# EAGLE board 261503933xxxx_HW-V1 (EAGLE 7.5.0)
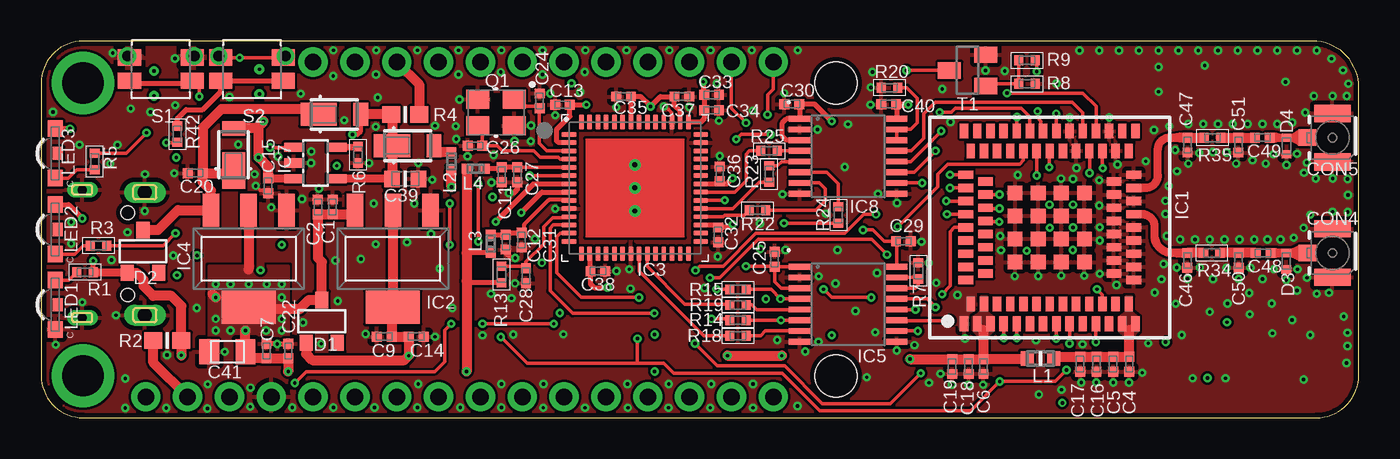
[diagram p3: board, top side]
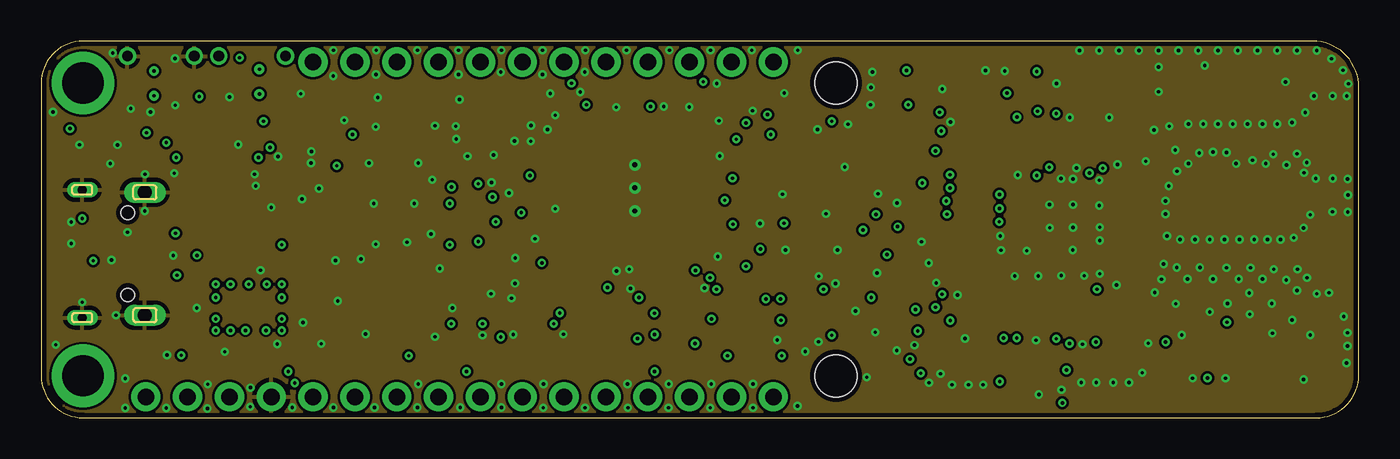
[diagram p4: board, inner layer Route2]
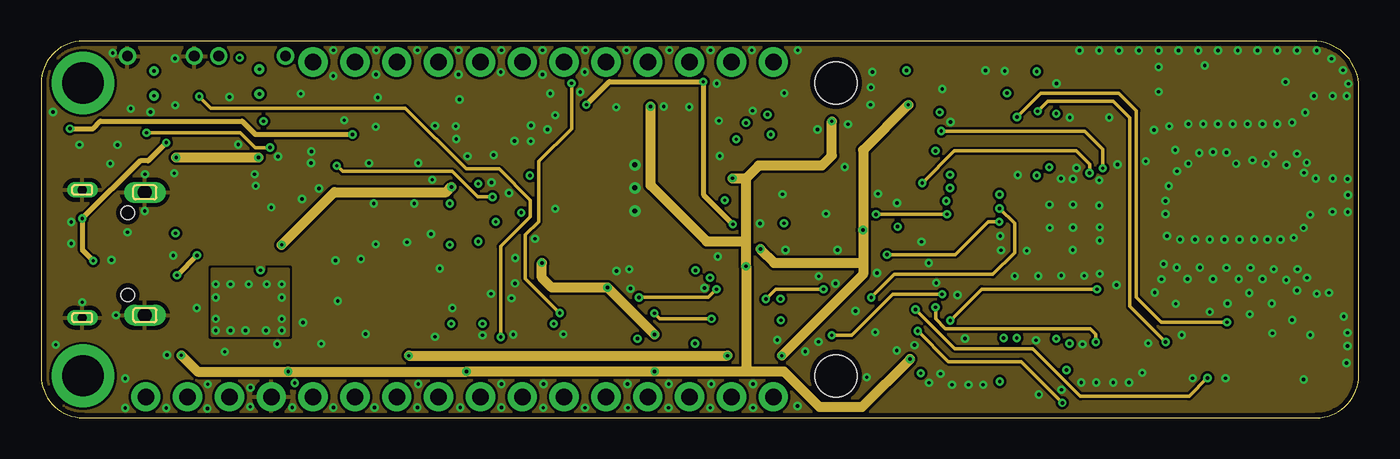
[diagram p5: board, inner layer Route15]
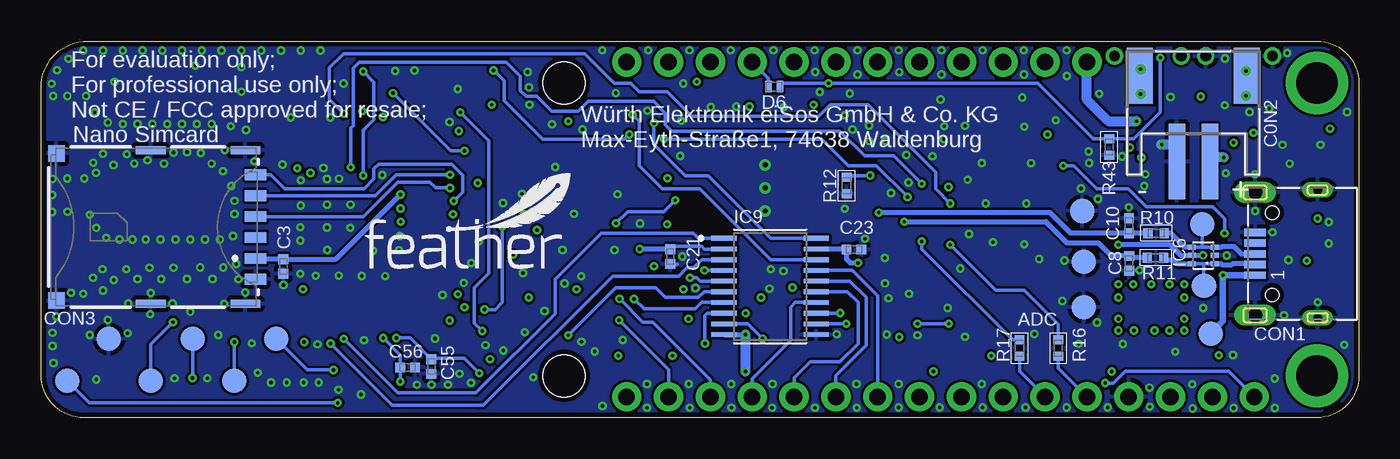
[diagram p6: board, bottom side, seen from below]

Size 80 x 22.86 mm. Coordinates in mm from the lower left corner, seen from the top.
Copper layers (1*2+15*16): Top 0.035mm / dielectric 0.41mm / Route2 0.035mm / dielectric 0.71mm / Route15 0.035mm / dielectric 0.41mm / Bottom 0.035mm
Design rules "default *": minimum track width 0.15mm, minimum drill 0.2mm, track to track 0.15mm, track to pad 0.15mm, pad to pad 0.2mm, via to via 0.2mm, smd to smd 0.2mm, copper to edge 0.3mm, drill to drill 0.3mm, minimum pad ring 0.2mm, minimum via ring 0.15mm, stop-mask expansion 0.05mm, vias tented up to drill 0.7mm, thermal gap 10mil
Net classes: 0 default: width 0.15 mm, drill 0.2 mm, clearance 0.15 mm; 1 VCC: width 0.2 mm, drill 0.2 mm, clearance 0.2 mm to class 0, clearance 0.2 mm; 4 VDDIO: width 0.2 mm, drill 0.2 mm, clearance 0.2 mm to class 0, clearance 0.2 mm to class 1, clearance 0.2 mm to class 2, clearance 0.2 mm to class 3, clearance 0.2 mm
tKeepout: area 15.6,20.3 to 45.7,22.8; area 4.9,0.1 to 35,2.6; area 35,0.1 to 45.8,2.6
tRestrict: area 27.3,17.2 to 27.9,19.7

## Footprints (pad centres in the part's own frame; a part is rotated, then mirrored left to right if it is on the bottom)
JST-PH-2-SMT-RA-ADRASTEA-ANGEPASST = smd 1 x 4.6: 1 1,-3.7; 2 -1,-3.7 | smd 1.6 x 3.4: NC1 -3.25,1.5; NC2 3.25,1.5 | drill 0.2: P$1 3.2,0.3; P$2 3.2,1.8; P$3 -3.2,0.4; P$4 -3.2,1.9
C0402_IPC = smd 0.6 x 0.6: 1 -0.45,0; 2 0.45,0
C0603_IPC = smd 0.95 x 1: 1 -0.8,0; 2 0.8,0
C0805 = smd 1.2 x 1.5: P$1 -1.1,0; P$2 1.1,0
629105150521 = smd 0.45 x 1.3: 1 -1.3,1.05; 2 -0.65,1.05; 3 0,1.05; 4 0.65,1.05; 5 1.3,1.05 | drill 0.85 pad 1.2 long: SHELL -3.725,1.05; SHELL1 3.725,1.05 | drill 0.55 pad 0.9 long: SHELL2 -3.875,-2.75; SHELL3 3.875,-2.75 | hole 0.8: -2.5,0; 2.5,0
693043020611 = smd 0.65 x 1.3: C1 1.91,6.2; C2 -0.63,6.2; C3 -1.9,6.2; C5 3.18,6.2; C6 0.64,6.2; C7 -3.17,6.2 | smd 1 x 1.03: S1 4.465,-5.89; S6 -4.465,-5.89 | smd 0.48 x 1.8: S2 4.66,-0.17; S3 4.66,5.58; S4 -4.67,5.58; S5 -4.67,-0.17
636101111001 = smd 1 x 1.05: 1 0,-1.525 | smd 1.05 x 2.2: 2 1.475,0; 3 -1.475,0
SOT23@1 = smd 0.8 x 1: 1 -0.95,-1.3; 2 0.95,-1.3; 3 0,1.3
WE-VE_FEMTOF_0402 = smd 0.5 x 0.6: 1 -0.5,0; 2 0.5,0
SOD123_POWERDI = smd 0.9 x 1.4: A 1.6,0 | smd 2.2 x 1.4: K -0.95,0
X1-DFN1006-2 = smd 0.4 x 0.7: 1 -0.35,0; 2 0.35,0
WIRL-CELL-2615011136000 = smd 0.508 x 0.89: 1 -5.2,-5.85; 2 -4.8,-4.65; 3 -4.4,-5.85; 4 -4,-4.65; 5 -3.6,-5.85; 6 -3.2,-4.65; 7 -2.8,-5.85; 8 -2.4,-4.65; 9 -2,-5.85; 10 -1.6,-4.65; 11 -1.2,-5.85; 12 -0.8,-4.65; 13 -0.4,-5.85; 14 0,-4.65; 15 0.4,-5.85; 16 0.8,-4.65; 17 1.2,-5.85; 18 1.6,-4.65; 19 2,-5.85; 20 2.4,-4.65; 21 2.8,-5.85; 22 3.2,-4.65; 23 3.6,-5.85; 24 4,-4.65; 25 4.4,-5.85; 26 4.8,-4.65; 27 5.2,-5.85; 44 4.8,4.65; 46 4,4.65; 47 5.2,5.85; 48 3.2,4.65; 49 4.4,5.85; 50 2.4,4.65; 51 3.6,5.85; 52 1.6,4.65; 53 2.8,5.85; 54 0.8,4.65; 55 2,5.85; 56 0,4.65; 57 1.2,5.85; 58 -0.8,4.65; 59 0.4,5.85; 60 -1.6,4.65; 61 -0.4,5.85; 62 -2.4,4.65; 63 -1.2,5.85; 64 -3.2,4.65; 65 -2,5.85; 66 -4,4.65; 67 -2.8,5.85; 68 -4.8,4.65; 69 -3.6,5.85; 71 -4.4,5.85; 73 -5.2,5.85 | smd 0.89 x 0.508: 28 3.9,-2.8; 29 5.1,-3.2; 30 3.9,-2; 31 5.1,-2.4; 32 3.9,-1.2; 33 5.1,-1.6; 34 3.9,-0.4; 35 5.1,-0.8; 36 3.9,0.4; 37 5.1,0; 38 3.9,1.2; 39 5.1,0.8; 40 3.9,2; 41 5.1,1.6; 42 3.9,2.8; 43 5.1,2.4; 45 5.1,3.2; 70 -3.9,2.8; 72 -3.9,2; 74 -3.9,1.2; 75 -5.1,3.2; 76 -3.9,0.4; 77 -5.1,2.4; 78 -3.9,-0.4; 79 -5.1,1.6; 80 -3.9,-1.2; 81 -5.1,0.8; 82 -3.9,-2; 83 -5.1,0; 84 -3.9,-2.8; 85 -5.1,-0.8; 87 -5.1,-1.6; 89 -5.1,-2.4; 91 -5.1,-3.2 | smd 0.89 x 0.89: 86 -2.1,2.1; 88 -0.7,2.1; 90 0.7,2.1; 92 2.1,2.1; 93 -2.1,0.7; 94 -0.7,0.7; 95 0.7,0.7; 96 2.1,0.7; 97 -2.1,-0.7; 98 -0.7,-0.7; 99 0.7,-0.7; 100 2.1,-0.7; 101 -2.1,-2.1; 102 -0.7,-2.1; 103 0.7,-2.1; 104 2.1,-2.1
SOT223-4 = smd 1 x 2: 1 -2.3,-2.95; 2 0,-2.95; 3 2.3,-2.95 | smd 3.3 x 2: 4 0,2.95
VQFN-56 = smd 0.9 x 0.3: 1 -4,3.25; 2 -4,2.75; 3 -4,2.25; 4 -4,1.75; 5 -4,1.25; 6 -4,0.75; 7 -4,0.25; 8 -4,-0.25; 9 -4,-0.75; 10 -4,-1.25; 11 -4,-1.75; 12 -4,-2.25; 13 -4,-2.75; 14 -4,-3.25; 29 4,-3.25; 30 4,-2.75; 31 4,-2.25; 32 4,-1.75; 33 4,-1.25; 34 4,-0.75; 35 4,-0.25; 36 4,0.25; 37 4,0.75; 38 4,1.25; 39 4,1.75; 40 4,2.25; 41 4,2.75; 42 4,3.25 | smd 0.3 x 0.9: 15 -3.25,-4; 16 -2.75,-4; 17 -2.25,-4; 18 -1.75,-4; 19 -1.25,-4; 20 -0.75,-4; 21 -0.25,-4; 22 0.25,-4; 23 0.75,-4; 24 1.25,-4; 25 1.75,-4; 26 2.25,-4; 27 2.75,-4; 28 3.25,-4; 43 3.25,4; 44 2.75,4; 45 2.25,4; 46 1.75,4; 47 1.25,4; 48 0.75,4; 49 0.25,4; 50 -0.25,4; 51 -0.75,4; 52 -1.25,4; 53 -1.75,4; 54 -2.25,4; 55 -2.75,4; 56 -3.25,4 | drill 0.3: P$1 0,1.4; P$2 0,0; P$3 0,-1.4
PW16(TSSOP16) = smd 0.35 x 1.3: 1 -2.275,-2.95; 2 -1.625,-2.95; 3 -0.975,-2.95; 4 -0.325,-2.95; 5 0.325,-2.95; 6 0.975,-2.95; 7 1.625,-2.95; 8 2.275,-2.95; 9 2.275,2.95; 10 1.625,2.95; 11 0.975,2.95; 12 0.325,2.95; 13 -0.325,2.95; 14 -0.975,2.95; 15 -1.625,2.95; 16 -2.275,2.95
WE-TVS_SOT563 = smd 0.5 x 0.3: 1 -0.7,0.5; 2 -0.7,0; 3 -0.7,-0.5; 4 0.7,-0.5; 5 0.7,0; 6 0.7,0.5
SOT23-5 = smd 0.55 x 1.2: 1 -0.95,-1.3; 2 0,-1.3; 3 0.95,-1.3; 4 0.95,1.3; 5 -0.95,1.3
SOP65P640X120-20N = smd 1.6 x 0.3: 1 -2.8,2.925; 2 -2.8,2.275; 3 -2.8,1.625; 4 -2.8,0.975; 5 -2.8,0.325; 6 -2.8,-0.325; 7 -2.8,-0.975; 8 -2.8,-1.625; 9 -2.8,-2.275; 10 -2.8,-2.925; 11 2.8,-2.925; 12 2.8,-2.275; 13 2.8,-1.625; 14 2.8,-0.975; 15 2.8,-0.325; 16 2.8,0.325; 17 2.8,0.975; 18 2.8,1.625; 19 2.8,2.275; 20 2.8,2.925
L0603_WE-MK = smd 0.8 x 0.9: 1 -0.8,0; 2 0.8,0
L0402_WE-MK = smd 0.6 x 0.6: P$1 -0.55,0; P$2 0.55,0
WL-SMSW_1204_A = smd 1 x 0.9: 1 -1.5,0; 2 1.5,0 | smd 0.8 x 0.6: 3 0,-0.15
FEATHERWING_80MM = drill 1 pad 1.778: 1 6.35,1.27; 2 8.89,1.27; 3 11.43,1.27; 4 13.97,1.27; 5 16.51,1.27; 6 19.05,1.27; 7 21.59,1.27; 8 24.13,1.27; 9 26.67,1.27; 10 29.21,1.27; 11 31.75,1.27; 12 34.29,1.27; 13 36.83,1.27; 14 39.37,1.27; 15 41.91,1.27; 16 44.45,1.27; 17 44.45,21.59; 18 41.91,21.59; 19 39.37,21.59; 20 36.83,21.59; 21 34.29,21.59; 22 31.75,21.59; 23 29.21,21.59; 24 26.67,21.59; 25 24.13,21.59; 26 21.59,21.59; 27 19.05,21.59; 28 16.51,21.59 | drill 2.5 pad 3.81: P$1 2.54,20.32; P$2 2.54,2.54 | hole 2.54: 48.26,20.32; 48.26,2.54
WE-XTAL_CFPX-180 = smd 1.4 x 1.15: 1 -1.1,-0.8; 2 1.1,-0.8; 3 1.1,0.8; 4 -1.1,0.8
R0402_IPC = smd 0.55 x 0.6: 1 -0.5,0; 2 0.5,0
R0603_IPC = smd 1.1 x 1: 1 -0.85,0; 2 0.85,0
434331013822 = smd 1.4 x 1: 1 -1.9,0.7; 2 1.9,0.7; 3 1.9,-0.7; 4 -1.9,-0.7 | drill 0.65 pad 0.78: 5 -2.025,-0.8; 6 2.025,-0.8
BSS138 = smd 1 x 1.4: D 0,1.1; G -0.95,-1.1; S 0.95,-1.1
TP15R = smd 1.5 x 1.5: P$1 0,0

## Placement (x,y rotation side)
C0N2  LiPoLy-Plug  [JST-PH-2-SMT-RA-ADRASTEA-ANGEPASST]  10.05,19.25 0 bottom
C1  100nF  [C0402_IPC]  17.7,12.8 270 top
C2  1uF  [C0402_IPC]  16.8,12.8 90 top
C3  100nF  [C0402_IPC]  65.3,9.18 270 bottom
C4  100nF  [C0402_IPC]  66.06,3.25 90 top
C5  10uF  [C0402_IPC]  65.08,3.25 270 top
C6  100nF  [C0402_IPC]  57.21,3.1 90 top
C7  4.7uF  [C0402_IPC]  13.68,4.05 90 top
C8  10pF  [C0402_IPC]  13.95,9.37 90 bottom
C9  1uF  [C0402_IPC]  20.83,4.92 180 top
C10  10pF  [C0402_IPC]  13.95,11.65 270 bottom
C11  4.7uF  [C0402_IPC]  27.96,14.75 270 top
C12  4.7uF  [C0402_IPC]  28.21,10.66 270 top
C13  4.7uF  [C0402_IPC]  31.65,19 180 top
C14  100nF  [C0402_IPC]  22.77,4.92 180 top
C15  10uF  [C0402_IPC]  13.78,14.09 270 top
C16  10uF  [C0402_IPC]  64.08,3.25 270 top
C17  1uF  [C0402_IPC]  63.08,3.25 270 top
C18  10uF  [C0402_IPC]  56.31,3.1 270 top
C19  10uF  [C0402_IPC]  55.31,3.1 270 top
C20  100nF  [C0402_IPC]  9.35,14.85 0 top
C21  100nF  [C0402_IPC]  41.8,9.78 270 bottom
C22  100nF  [C0402_IPC]  15,4.05 270 top
C23  100nF  [C0402_IPC]  30.66,10.21 0 bottom
C24  27pF  [C0402_IPC]  30.26,19.23 270 top
C25  100nF  [C0402_IPC]  44.53,9.62 270 top
C26  27pF  [C0402_IPC]  26.34,16.51 0 top
C27  100nF  [C0402_IPC]  28.91,14.75 90 top
C28  100nF  [C0402_IPC]  29.43,8.62 90 top
C29  100nF  [C0402_IPC]  52.35,10.71 180 top
C30  100nF  [C0402_IPC]  45.58,19.04 0 top
C31  100nF  [C0402_IPC]  29.18,10.78 90 top
C32  100nF  [C0402_IPC]  41.1,11.1 90 top
C33  100nF  [C0402_IPC]  40.7,19.6 180 top
C34  100nF  [C0402_IPC]  40.7,18.66 180 top
C35  100nF  [C0402_IPC]  35.36,19.5 0 top
C36  100nF  [C0402_IPC]  41.2,14.8 270 top
C37  100nF  [C0402_IPC]  38.9,19.5 180 top
C38  100nF  [C0402_IPC]  33.8,8.9 180 top
C39  10uF  [C0603_IPC]  22.1,14.5 180 top
C40  100nF  [C0402_IPC]  51.45,19.04 0 top
C41  47µF  [C0805]  11.3,4 180 top
C46  n.m.  [C0402_IPC]  69.59,9.55 90 top
C47  n.m.  [C0402_IPC]  69.6,16.55 90 top
C48  100pF  [C0402_IPC]  74.19,10 180 top
C49  100pF  [C0402_IPC]  74.15,17 180 top
C50  n.m.  [C0402_IPC]  72.7,9.55 90 top
C51  n.m.  [C0402_IPC]  72.69,16.55 90 top
C55  100nF  [C0402_IPC]  56.31,3.1 90 bottom
C56  n.m.  [C0402_IPC]  57.75,3.05 180 bottom
CON1  Micro_USB  [629105150521]  5.25,9.95 90 bottom
CON3  693043020611  [693043020611]  73.18,11.58 270 bottom
CON4  636101111001  [636101111001]  78.4,10 270 top
CON5  636101111001  [636101111001]  78.4,17 270 top
D1  n.m.  [SOT23@1]  17.04,5.85 0 top
D2  n.m.  [SOT23@1]  6.18,10.1 0 top
D3  8231706A  [WE-VE_FEMTOF_0402]  75.59,9.5 270 top
D4  8231706A  [WE-VE_FEMTOF_0402]  75.61,16.5 270 top
D5  DFLS130L-7  [SOD123_POWERDI]  22.25,16.52 0 top
D6  BAT540402_X1-DFN1006-2  [X1-DFN1006-2]  35.5,20.1 180 bottom
D7  DFLS130L-7  [SOD123_POWERDI]  17.8,18.41 0 top
D8  DFLS130L-7  [SOD123_POWERDI]  11.69,15.96 90 top
IC1  WIRL-CELL-2615011136000  [WIRL-CELL-2615011136000]  61.23,11.55 0 top
IC2  TLV1117LV18DCY  [SOT223-4]  21.35,9.65 180 top
IC3  FT4232H-56Q  [VQFN-56]  36.05,13.95 0 top
IC4  TLV1117LV33DCY  [SOT223-4]  12.6,9.65 180 top
IC5  SN74AVC4T245PWR  [PW16(TSSOP16)]  48.99,6.89 270 top
IC6  82400152  [WE-TVS_SOT563]  9.45,9.86 180 bottom
IC7  MCP73831T-2ACI/OT  [SOT23-5]  16.65,15.46 270 top
IC8  SN74AVC4T245PWR  [PW16(TSSOP16)]  48.99,15.88 270 top
IC9  TXS0108EPWR  [SOP65P640X120-20N]  35.74,7.97 0 bottom
L1  742792625  [L0603_WE-MK]  60.67,3.6 0 top
L2  7427927311  [L0402_WE-MK]  24.91,15.57 270 top
L3  7427927311  [L0402_WE-MK]  27.29,10.56 270 top
L4  7427927311  [L0402_WE-MK]  26.39,15.12 180 top
LED1  Red  [WL-SMSW_1204_A]  0.86,6.86 90 top
LED2  Blue  [WL-SMSW_1204_A]  0.86,11.43 90 top
LED3  Yellow  [WL-SMSW_1204_A]  0.86,16.05 90 top
MS1  FEATHERWING_80MM  [FEATHERWING_80MM]  0,0 0 top
Q1  12MHz/±20 ppm  [WE-XTAL_CFPX-180]  27.61,18.53 180 top
R1  4k7R  [R0402_IPC]  2.66,8.84 0 top
R2  0R  [R0603_IPC]  7.66,4.68 180 top
R3  2.2k  [R0402_IPC]  3.48,10.45 0 top
R4  0R  [R0603_IPC]  22.1,18.4 180 top
R5  4k7R  [R0402_IPC]  3.25,15.55 90 top
R6  5k1R  [R0402_IPC]  19.23,15.96 90 top
R7  100k  [R0402_IPC]  53.26,8.92 90 top
R8  100k  [R0402_IPC]  59.84,20.27 0 top
R9  10k  [R0402_IPC]  59.84,21.7 180 top
R10  10R  [R0402_IPC]  12.3,11.2 180 bottom
R11  10R  [R0402_IPC]  12.34,9.71 0 bottom
R12  12k  [R0402_IPC]  31.1,14.09 90 bottom
R13  1k  [R0402_IPC]  27.95,8.69 90 top
R14  10R  [R0402_IPC]  42.3,5.92 0 top
R15  10R  [R0402_IPC]  42.3,7.79 0 top
R16  n.m.  [R0402_IPC]  18.25,4.22 270 bottom
R17  n.m.  [R0402_IPC]  20.6,4.22 270 bottom
R18  10R  [R0402_IPC]  42.3,4.98 0 top
R19  10R  [R0402_IPC]  42.3,6.84 0 top
R20  100k  [R0402_IPC]  51.5,20.04 180 top
R22  10R  [R0402_IPC]  43.5,12.6 0 top
R23  10R  [R0402_IPC]  44.2,14.8 90 top
R24  10R  [R0402_IPC]  48.4,12.3 90 top
R25  10R  [R0402_IPC]  44.2,16.2 0 top
R34  0R  [R0402_IPC]  71.07,10 180 top
R35  0R  [R0402_IPC]  71.11,17 180 top
R42  100R  [R0402_IPC]  8.27,17.21 90 top
R43  1k  [R0402_IPC]  15.16,16.43 270 bottom
S1  [434331013822]  7.26,21.16 180 top
S2  [434331013822]  12.8,21.16 180 top
T1  BSS138  [BSS138]  56.24,21.09 90 top
TP1  TP15R  [TP15R]  78.43,2.25 0 bottom
TP2  TP15R  [TP15R]  73.35,2.25 0 bottom
TP3  TP15R  [TP15R]  70.81,4.79 0 bottom
TP4  TP15R  [TP15R]  68.27,2.25 0 bottom
TP5  TP15R  [TP15R]  65.73,4.79 0 bottom
TP6  TP15R  [TP15R]  75.89,4.79 0 bottom
TP7  TP15R  [TP15R]  9.5,11.75 0 bottom
TP8  TP15R  [TP15R]  9.4,8 0 bottom
TP9  TP15R  [TP15R]  9,5.1 0 bottom
TP10  TP15R  [TP15R]  16.8,12.55 0 bottom
TP11  TP15R  [TP15R]  16.7,9.47 0 bottom
TP12  TP15R  [TP15R]  16.7,6.7 0 bottom
U$4  [FEATHER_12MM]  60.4,9.05 0 bottom

## Tracks (layer width: path | path; a pad name or v marks a point on that pad's centre or on a via)
1V8  (via drill 0.2)
  Top 0.2: 52,9.22 IC5.16 51.95,10.56 52,10.62 C29.2 51.19,10.71 50.5,11.4 v49.9,11.4
  Top 0.3: 51.94,19 51.94,18.16 IC8.16
  Top 0.4: v52.65,19 51.94,19 C40.2
  Top 0.6: IC2.2 IC2.4 21.22,6.57 21.28,6.51 C9.1 C14.2 v22.32,3.77 22.05,3.5 16.46,3.5 16.09,3.87 D1.1 | v41.66,3.77 v44.97,3.77
  Route15 0.6: v52.65,19 49.9,16.25 v49.9,11.4 49.9,9.4 | v44.97,3.77 49.9,8.7 49.9,9.4 | v43.66,10.23 44.5,9.4 49.9,9.4 | v22.32,3.77 v41.66,3.77
  Bottom 0.2: IC9.2 38.55,10.23 39.73,10.23 39.9,10.4 41.63,10.4 C21.1 41.73,10.3 | v43.66,10.23
  Bottom 0.3: C21.1 v43.66,10.23
3V
  Top 0.6: MS1.2 6.81,3.35 R2.2
3V3  (via drill 0.2)
  Top 0.2: IC1.4 57.24,6.89 | IC5.3 44.94,7.87 44.53,8.27 C25.2 | v42.8,9.2 44.51,9.2 C25.2 | IC5.1 44.55,9.16 C25.2 | R1.2 | 41.05,14.2 C36.2 | R42.1 8.26,16.7 v7.6,16.7
  Top 0.3: LED2.2 1.67,12.93 v2.5,12.1 | IC8.1 45.25,18.15 45,17.9 45,17.1 45.25,16.85 IC8.3 | IC3.44 38.8,18.6 38.45,18.95 C37.2 37.6,19.5 v37,18.9 36.4,19.5 C35.2 IC3.50 | 57.2,5.33 IC1.3 | R1.2 v3.17,9.54 | 3.19,8.8 R1.2 | IC3.36 41.05,14.2 | IC3.16 33.3,8.95 C38.2 33.35,8.12 33.57,7.9 v34.39,7.9 | 25.84,10 25.85,10.02 L3.P$2 | R13.1 25.95,8.19 25.84,8.3 | C36.2 41.35,14.2 41.63,14.2 v41.97,14.54 | IC8.1 46.02,18.17 | v48.01,18 46.97,19.04 C30.2 46.05,19.02 IC8.1
  Top 0.4: R13.1 27.9,8.13 | C6.2 57.2,3.6
  Top 0.5: D2.1 3.19,8.8
  Top 0.6: v52.76,3.56 C19.1 C18.1 C6.2 | L1.1 59.83,3.56 C6.2 | IC4.4 12.95,7.05 13.4,6.6 15.7,6.6 16.25,7.15 D1.3 17.04,9.46 16.8,9.7 C2.1 | IC4.2 12.6,9 | D2.1 5.8,8.8 6.2,8.4 6.2,8 6.8,7.4 7.9,7.4 8.51,6.79 R2.1 v8.51,3.79 | 10.4,7.5 v10.6,7.3 | C2.1 C1.2 | C2.1 18.8,12.35 IC2.3 | L4.P$2 25.84,10 25.84,8.3 v25.84,2.81 v25.83,2.8 | v15,2.8 C22.2 C7.1 12.8,3.6 C41.P$1 v12.4,5.3 | 57.2,5.33 C6.2
  Route15 0.3: v3.17,9.54 2.5,10.2 v2.5,12.1 6,15.6 6.5,15.6 v7.6,16.7
  Route15 0.6: v48.01,18 48.01,15.9 47.4,15.3 43.56,15.3 42.8,14.54 | v52.76,3.56 49.84,0.64 47.27,0.64 45.1,2.8 42.8,2.8 | 42.8,2.8 v37.24,2.8 v25.83,2.8 v15,2.8 9.5,2.8 v8.51,3.79 | 42.8,10.7 v42.8,9.2 42.8,2.8 | 42.8,10.7 42.8,14.54 | 42.8,10.7 40.4,10.7 37,14.1 v37,18.9 | v41.97,14.54 42.8,14.54 | v37.24,5.04 v34.39,7.9 31,7.9 30.4,8.5 v30.4,9.4
  Bottom 0.2: 31.14,10.24 C23.1
  Bottom 0.3: IC9.19 31.14,10.24 | C23.1 31.11,9.61 30.9,9.4 v30.4,9.4 | IC9.10 v37.24,5.04
  Bottom 0.6: v37.24,5.04 v37.24,2.8
  other vias: 14.6,5.3 10.6,5.3 10.6,8.1 13.65,5.3 14.6,8.1 14.6,7.3 13.7,8.1 11.5,8.1 14.6,6 10.6,6 12.6,8.1 11.5,5.3
  pour Top: 15,9.2 15,4.8 10.2,4.8 10.2,9.2
  pour Top (rank 2, no thermals): 57.39,7.33 57.08,7.33 57.08,6.4 56.6,6.1 56.6,5.3 57.8,5.3 57.8,6.1 57.3,6.5
  pour Top (rank 2, no thermals): 56.6,5.3 57,4.9 57,4.7 57.4,4.7 57.4,4.9 57.8,5.3
  pour Route15 (no thermals): 15,9 15,5 10.4,5 10.4,9
3V3_FEM
  Top 0.2: IC1.27 66.42,5.71
  Top 0.3: 66.06,5.33 IC1.27
  Top 0.6: L1.2 61.58,3.7 C17.1 C16.1 C5.1 C4.2 66.06,5.33
  pour Top (no thermals): 65.9,4.8 65.9,4.75 66.26,4.74 66.25,4.9
  pour Top (rank 2, no thermals): 66.19,7.33 65.88,7.33 65.88,6.4 65.41,6.08 65.41,5.3 66.61,5.3 66.61,6.08 66.19,6.4
  pour Top (rank 2, no thermals): 65.41,5.3 65.84,4.9 65.84,4.71 66.21,4.7 66.23,4.9 66.61,5.3
5V_IN
  Top 0.5: 11.32,14.65 D8.K
  Top 0.6: C20.2 9.8,17.6 10.95,18.75 16.48,18.75 16.82,18.41 D7.K | C20.2 11.53,14.85 D8.K | C20.2 9.8,14.3 10.3,13.8 IC4.3 8.3,12.6 7.1,11.4 D2.3
/RESET_3V3  (via drill 0.2)
  Top 0.2: v31.12,5.7 v26.8,5.7 | v15.4,2.1 16.1,2.8 23.9,2.8 24.5,3.4 24.5,5.3 v24.9,5.7
  Bottom 0.2: IC9.12 v31.12,5.7 | v26.8,5.7 v24.9,5.7 | MS1.1 7.89,2.81 14.19,2.81 14.9,2.1 v15.4,2.1
ADC0  (via drill 0.2)
  Top 0.2: 61.65,17.41 IC1.59 v61.63,18.46 | v24.8,10.5 v24.8,13
  Bottom 0.2: v61.63,18.46 62.51,19.33 62.51,21.23 61.64,22.1 47,22.1 45.2,20.3 44.2,20.3 43.7,19.8 42,19.8 40.5,18.3 32.8,18.3 32.1,19 29.8,19 25.7,14.9 25.7,13.9 v24.8,13 | R16.1 18.25,5.67 20.32,7.74 22.04,7.74 v24.8,10.5
ADC1  (via drill 0.2)
  Top 0.2: IC1.56 61.2,16.16 v61.2,15.2 | v26.54,10.7 v26.54,14.2
  Bottom 0.2: v61.2,15.2 61.2,17.6 61.06,17.74 61.06,21.23 60.7,21.59 51.77,21.59 50.9,20.72 50.9,19.86 50.55,19.51 49.91,19.51 49,18.6 47.4,18.6 46.8,19.2 42.82,19.2 42.1,18.48 42.1,17.8 41.7,17.4 31.5,17.4 30,15.9 28.24,15.9 v26.54,14.2 | v26.54,10.7 26.54,10.24 21.02,4.72 R17.1
ADC_0
  Bottom 0.2: MS1.5 18.25,3.01 R16.2
ADC_1
  Bottom 0.2: MS1.6 20.6,2.82 R17.2
D+
  Bottom 0.2: IC6.4 9.45,10.36 | 9.45,10.36 IC6.3 8.65,10.36 | TP7.P$1 9.5,10.4 9.45,10.36
  Bottom 0.3: 8.65,10.36 8.65,10.35 | CON1.3 7.15,9.95 7.6,10.4 8.3,10.4 8.35,10.36 IC6.3 | IC6.4 10.55,10.36 11.4,11.2 R10.1
D-
  Bottom 0.2: IC6.6 9.45,9.36 | 9.45,9.36 IC6.1 | TP8.P$1 9.4,9.3 9.45,9.36
  Bottom 0.3: IC6.1 | CON1.2 6.36,9.36 7.64,9.36 7.7,9.3 8.3,9.3 8.36,9.36 IC6.1 | R11.2 11.72,9.6 11.3,9.6 11.05,9.36 IC6.6
FEATHER_USB
  Top 0.6: MS1.26 22.95,20.23 R4.1
FTDI_1V8_VCORE  (via drill 0.2)
  Top 0.2: 40.2,19.65 C33.2 | 40.95,11.7 C32.2
  Top 0.3: C33.2 C34.2 40.25,18.15 40.05,17.95 IC3.43 | v40.2,20.4 40.2,19.65 | v41.99,11.75 41.8,11.55 C32.2 | IC3.31 40.95,11.7 | IC3.2 31.4,16.7 31.3,16.8 31.3,17.5 32.1,18.3 C13.1 v33.1,19
  Route15 0.3: v33.1,19 34.5,20.4 v40.2,20.4 40.2,13.54 v41.99,11.75
FTDI_CTS#_CH-C
  Top 0.2: IC3.35 42.1,13.7 42.8,14.4 42.8,16 43,16.2 R25.1
FTDI_RESET
  Top 0.2: R13.2 29.32,9.19 C28.2 29.43,9.46 30.5,10.53 30.5,11.6 31.05,12.15 32,12.15 IC3.11
FTDI_RTS#_CH-C  (via drill 0.2)
  Top 0.2: IC3.34 v41.5,13.2 | v45.1,11.8 R24.1
  Bottom 0.2: v41.5,13.2 42.2,12.5 44.4,12.5 v45.1,11.8
FTDI_RXD_CH-A  (via drill 0.2)
  Top 0.2: IC3.13 31.5,11.2 31.3,11 31.3,8.8 32.8,7.3 v36.3,7.3 | R15.1 41.78,7.8 v41,7.8
  Route15 0.2: v41,7.8 40.5,7.3 v36.3,7.3
FTDI_RXD_CH-B
  Top 0.2: IC3.23 36.8,9.18 39.08,6.9 41.74,6.9 R19.1
FTDI_RXD_CH-C
  Top 0.2: IC3.33 42,12.7 43.6,14.3 R23.1
FTDI_TXD_CH-A  (via drill 0.2)
  Top 0.2: IC3.12 31.1,11.7 30.9,11.5 30.9,7.7 32.26,6.34 v37.23,6.34 | v40.7,6 41.72,6 R14.1
  Route15 0.2: v37.23,6.34 37.57,6 v40.7,6
FTDI_TXD_CH-B
  Top 0.2: IC3.22 36.3,8.9 40.22,4.98 R18.1
FTDI_TXD_CH-C
  Top 0.2: IC3.32 41.4,12.2 41.5,12.3 42.7,12.3 R22.1
GND  (via drill 0.2)
  Top 0.2: IC3.45 38.3,18.5 37.91,18.89 v37.8,18.89 | 13.7,13.6 13.5,13.8 13.3,13.8 v13.03,14.07
  Top 0.3: v28.78,9.7 28.51,9.7 28.21,10 C12.2 | C27.1 28.91,13.87 28.7,13.64 v28.4,13.64 | C7.2 13.71,4.47 v14.33,4.47 14.97,4.47 C22.1
  Bottom 0.2: 41.37,9.33 C21.2 | 41.4,9.3 41.7,9.3
  Bottom 0.6: 12,16.6 11.1,16.6
  other vias: 14.38,15.87 12.71,1.82 22.9,2.05 27.94,2.05 30.48,0.6 33.02,0.61 35.6,2.05 38.09,0.6 40.68,2.05 43.22,2.05 55.3,2 65.08,2.14 57.19,2 56.3,2 67.22,4.52 66.05,2.14 63.15,2.14 64.06,2.14 53.02,4.41 33.01,20.98 31.21,12.69 28.74,16.8 35.71,9.01 26.8,5 31.7,5.06 51.94,4.08 44.7,4.71 56.09,4.8 60.58,1.41 60.41,4.71 45.01,13.56 46.39,4.01 22.64,13 19.91,15.46 25.17,17.7 20.31,17.66 15.83,13.28 23.91,17.72 30.43,20.84 62.87,15.16 65.35,15.38 62.65,14.48 61.65,20.29 58.51,21.05 59.3,14.73 64.85,18.23 47.13,17.5 50.38,20.05 50.8,13.6 69.65,15.43 70.31,16.07 71.96,16.11 72.55,15.43 76.67,14.88 79.32,14.49 78.42,14.53 72.75,10.82 71.85,10.82 70.95,10.82 70.05,10.82 69.15,10.82 69.65,17.82 70.55,17.82 71.45,17.82 73.25,17.82 74.15,17.82 77.27,19.52 78.41,19.52 75.59,8.36 72.71,8.43 71.96,9.11 70.35,9.12 69.6,8.43 78.19,7.58 75.95,5.92 48.99,17.82 59.12,8.6 60.53,8.61 61.94,8.62 19.41,9.63 27.31,7.53 28.55,7.25 48.34,10.19 47.22,8.59 43.65,11.79 45.2,10.19 51.95,13.04 4.34,22.14 8.12,21.8 24.2,9.05 39.34,18.87 54.59,2.67 29.73,16.79 8.08,14.85 17,4.49 69.91,2.39 5.1,2.38 29.98,10.87 15.24,0.62 12.69,0.67 35.77,7.83 23.91,4.92 30.91,19.69 41.15,18.03 43.2,18.64 41.2,15.89 34.91,18.85 22.21,10.65 20.31,10.53 8.02,9.85 16.87,13.92 24.96,6.66 53.45,10.69 41.08,9.78 62.45,18.23 64.27,11.56 58.28,10.16 64.25,12.88 64.27,10.77 65.28,8.05 67.61,7.59 68.27,12.37 67.56,17.46 70.95,6.42 77.05,5.03 74.75,5.12 25.41,19.32 25.2,16.92 77.39,14.53 77.05,12.32 68.27,13.16 68.97,14.96 77.45,7.53 76.75,18.52 18.4,18.05 27.47,15.96 30.74,17.5 19.7,5.08 64.25,14.41 61.22,12.94 62.65,12.94 62.65,11.54 61.23,11.54 62.63,10.19 58.23,11.04 59.84,10.13 61.91,14.52 45.94,22.3 47.65,12.38 55.2,17.95 15.9,5.79 7.6,0.58 13.96,12.77 1.83,11.88 1.83,10.57 63.23,4.46 4.26,9.57 27.34,14.29 72.35,17.82 75.05,17.82 75.95,17.93 73.55,15.62 74.35,15.43 75.61,15.34 73.65,10.82 74.45,10.82 75.25,10.82 76.05,10.93 78.4,12.51 79.33,12.49 73.42,9.11 74.83,9.02 76.25,7.72 79.08,6.14 67.06,15.56 68.47,14.06 68.35,11.03 68.15,9.32 4.54,6.21 9.44,6.67 6.29,12.55 8.14,18.96 7.64,3.8 17.86,9.55 5.44,18.77 23.75,14.45 28.77,8.15 27.91,20.98 25.34,20.84 20.34,20.84 17.73,20.74 43.14,22.3 40.64,22.3 38.14,22.3 35.54,22.3 33.04,22.3 30.44,22.3 27.94,22.3 25.34,22.3 22.84,22.3 20.34,22.3 17.74,22.3 17.74,0.62 20.24,0.62 22.84,0.62 25.44,0.62 27.94,0.62 35.62,0.61 40.62,0.61 43.22,0.61 45.92,0.71 50.12,2.45 48.22,8.15 73.38,6.28 50.47,20.98 57.34,21.09 54.7,19.95 63.05,22.29 67.84,21.29 67.84,19.79 78.34,21.79 75.55,20.39 70.64,21.39 66.85,2.73 79.25,3.33 50.74,8.79 50.65,5.18 49.45,6.49 48.79,15.21 64.28,8.73 10.12,2.02 16.38,15.46 29.74,17.75 2.33,16.57 2.49,7.01 12.96,14.79 5.24,11.27 0.89,4.43 18,7.08 40.27,7.88 38.1,2.05 30.5,2.05 10.09,0.56 5.1,0.58 41.02,20.29 47.19,4.62 53.91,2.12 54.34,8.19 53.88,9.38 50.34,19 69.25,5.03 6.64,18.57 4.64,16.57 23.67,11.15 16.41,16.16 22.89,15.46 28.66,5.05 76.27,9.02 76.25,16.02 76.84,15.48 76.85,8.49 76.65,11.53 79.27,19.53 13.32,8.96 6.3,14.78 15.76,19.67 20.43,19.44 34.93,8.91 71.15,16.12 74.81,15.99 74.15,8.43 71.15,8.43 61.95,1.7 76.65,2.33 71.91,2.39 11.44,19.48 73.35,7.58 72.02,6.93 74.71,6.93 68.95,9.12 25.89,15.87 55.63,7.46 68.5,17.69 20.2,13 11.14,4 63.34,8.62 32.73,19.77 45.12,19.7 31.21,18.36 4.2,15.43 68.86,16.25 68.02,8.4 68.88,6.92 64.25,22.29 65.44,22.29 66.64,22.29 67.84,22.29 69.05,22.29 70.25,22.29 71.44,22.29 72.64,22.29 73.84,22.29 75.05,22.29 76.25,22.29 77.44,22.29 79.05,21.09 79.36,20.28 79.34,13.52 79.31,5.16 79.31,4.36 0.71,18.56 11.96,16.59
  pour Bottom: 0,21 0,0 80,0 80,23 0,23
  pour Top (rank 3): 0,23 0,0 80,0 80,23
  pour Route2: 0,23 0,0 80,0 80,23
  pour Route15 (rank 2): 0,23 0,0 80,0 80,23
  pour Top (no thermals): 55.83,5.34 55.51,6.27 55.7,7.6 55.8,7.6 56.72,7.58 56.64,6.54 56.23,6.3 56.23,5.33
GNSS_RX
  Top 0.2: C47.2 69.4,16.8 69.1,16.8 68.25,16.9 | 69.6,17.2 69.1,17.2 68.25,17.1 68.5,17
  Top 0.5: 67.04,13.95 arc90 67.8,14.71 67.8,16.3 arc-90 68.5,17 C47.2
  Top 0.508: IC1.43 67.04,13.95
  Top 0.6: C47.2 R35.2
GPIO_RX  (via drill 0.2)
  Top 0.2: R15.2 44.31,7.79 v44.88,7.21 IC5.4
  Bottom 0.2: MS1.14 39.37,2.3 42.87,5.8 43.47,5.8 v44.88,7.21
GPIO_TX  (via drill 0.2)
  Top 0.2: R14.2 v44.91,5.92 IC5.6
  Bottom 0.2: MS1.15 41.91,2.92 v44.91,5.92
I2C_SCL  (via drill 0.2)
  Top 0.2: v42.8,17.9 41.91,18.79 MS1.18
  Bottom 0.2: IC9.20 35.7,10.89 39.5,14.7 40.9,14.7 42.8,16.6 v42.8,17.9
I2C_SDA  (via drill 0.2)
  Top 0.2: MS1.17 44.45,19.95 44.1,19.6 v44.1,18.4
  Bottom 0.2: IC9.18 35.7,9.6 40,13.9 42.3,13.9 43.7,15.3 43.7,18 v44.1,18.4
LS_ISO_CTRL1
  Top 0.2: IC8.14 IC8.15 52.8,17.5 53.2,17.9 53.2,19.4 52.56,20.04 R20.1
LTE_RXTX
  Top 0.2: 68.47,10.14 69.3,10.2 69.5,10 C46.2 69.39,9.8 69.27,9.8 68.47,9.87
  Top 0.5: 69.5,10 68.68,10 arc-90 67.6,11.08 67.6,11.6 arc90 66.85,12.35
  Top 0.508: 66.85,12.35 IC1.39
  Top 0.6: R34.2 C46.2
M_/RESET  (via drill 0.2)
  Top 0.2: S1.2 5.44,20.46 | IC1.9 v59.23,4.84 | v62.26,2.9 61.55,2.2 v58.2,2.2 56.44,0.43 47.27,0.43 45,2.7 38.4,2.7 37.8,3.3 36.2,3.3 | S1.2 5.46,20.36 5.56,20.46 | 9.19,20.46 S1.1 9.6,20.02 v9.6,19.5 | 5.34,20.46 S1.2 | v27.9,4.9 29.5,3.3 36.2,3.3 | v36.2,4.8 36.2,3.3
  Top 0.3: S1.2 5.52,20.3 8.6,20.3 8.76,20.46 S1.1
  Route15 0.2: v9.6,19.5 10.3,18.8 22.1,18.8 25.8,15.1 27.8,15.1 29.7,13.2 29.7,12.2 27.9,10.4 v27.9,4.9
  Bottom 0.2: TP5.P$1 63.84,2.9 v62.26,2.9 | v59.23,4.84 58.2,3.81 C56.2 v58.2,2.2 | IC9.9 37.09,5.7 v36.2,4.8
M_I2C_SCL  (via drill 0.2)
  Top 0.2: v61.63,4.79 IC1.15
  Bottom 0.2: IC9.1 40.09,10.89 40.4,11.2 46,11.2 48.8,8.4 48.8,6.31 53.61,1.5 58.34,1.5 v61.63,4.79
M_I2C_SDA  (via drill 0.2)
  Top 0.2: IC1.17 v62.44,4.5
  Bottom 0.2: IC9.3 39.91,9.6 40.4,9.1 40.8,9.1 41.3,8.6 45.3,8.6 53.15,0.75 53.25,0.75 53.5,0.75 58.69,0.75 v62.44,4.5
M_SPI_CLK  (via drill 0.2)
  Top 0.2: IC1.76 57.38,11.9 v58.17,11.9 | v51.35,9.9 50.41,10.84 43.54,10.84 41.2,8.5 v40.6,8.5
  Route15 0.2: v58.17,11.9 57.5,11.9 55.5,9.9 v51.35,9.9
  Bottom 0.2: IC9.5 39.99,8.29 40.2,8.5 v40.6,8.5
M_SPI_CS  (via drill 0.2)
  Top 0.2: IC1.81 v55,12.35 | v50.69,12.35 49.95,12.35 48.8,11.2 43.4,11.2 41.4,9.2 39.98,9.2 v39.73,8.95
  Route15 0.2: v50.69,12.35 v55,12.35
  Bottom 0.2: IC9.4 v39.73,8.95
M_SPI_MISO  (via drill 0.2)
  Top 0.2: IC1.74 57.38,12.7 v58.19,12.7 | v47.5,7.8 48,7.3 v50.4,7.3
  Route15 0.2: v44,7.2 44.6,7.8 v47.5,7.8 | v58.19,12.7 v58.2,12.7 59.1,11.8 59.1,10.02 57.78,8.7 51.8,8.7 v50.4,7.3
  Bottom 0.2: IC9.7 39.91,7 40.3,6.6 43.4,6.6 v44,7.2
M_SPI_MOSI  (via drill 0.2)
  Top 0.2: IC1.83 55.45,11.55 55.2,11.3 55.2,8 v54.7,7.5
  Route15 0.2: v54.7,7.5 51.7,7.5 49.2,5 v48,5
  Bottom 0.2: v48,5 45.1,7.9 42.7,7.9 42.1,7.3 40.1,7.3 39.76,7.64 IC9.6
M_WAKEUP  (via drill 0.2)
  Top 0.2: IC1.7 v58.44,4.84 | v39.7,4.5 41.06,3.14 45.14,3.14 47.43,0.85 51.55,0.85 v53.4,2.7
  Bottom 0.2: IC9.8 39.55,6.34 39.7,6.2 v39.7,4.5 | v53.4,2.7 54.3,3.6 56.27,3.6 C55.2 57.59,4.84 v58.44,4.84
N$1
  Top 0.2: LED1.2 1.68,8.36 R1.1
N$2
  Top 0.2: LED2.1 2.03,9.93 2.55,10.45 R3.1
N$3
  Bottom 0.2: D6.2 35.85,20.61 MS1.20
N$4
  Top 0.2: 75.4,16.9 75,16.8 74.8,16.8 C49.1 74.8,17.2 75,17.2 75.4,17.1 | D4.1 75.71,16.9
  Top 0.3: D4.1 75.71,17.1 75.95,17.1 76.38,17.35 76.5,17.35 | 75.71,16.9 75.97,16.9 76.37,16.65 76.44,16.65
  Top 0.5: C49.1 D4.1 CON5.1
N$5  (via drill 0.2)
  Top 0.3: IC3.7 29.9,14.2 v27.6,11.9
  Bottom 0.3: R11.1 13.84,9.71 C8.2 15.02,9.82 15.8,10.6 17.7,10.6 19,11.9 v27.6,11.9
N$6
  Top 0.2: C48.1 74.84,10.2 75,10.2 75.6,10.1 | 74.84,9.8 75,9.8 75.6,9.9 D3.1 75.9,10 76.03,10.1
  Top 0.4: CON4.1 76.58,9.7 76.37,9.7 arc10 76.03,9.9 | 76.03,10.1 76.37,10.3 76.7,10.3
  Top 0.5: CON4.1 D3.1 C48.1
N$7
  Top 0.3: R42.2 8.27,18.16 8.8,18.7 9.8,18.7 10.9,19.8 S2.2 S2.1
  Top 0.4: R42.2 8.27,17.66
N$8
  Top 0.6: C48.2 C50.2 R34.1
N$9  (via drill 0.2)
  Top 0.2: T1.D v52.53,21.09 | v42.2,16.9 42.5,17.2 v44.3,17.2 | R3.2 7.4,10.45 v8.15,11.2
  Route15 0.2: v27.4,13.4 26.5,13.4 24.95,14.95 18.3,14.95 v17.95,15.3
  Bottom 0.2: v52.53,21.09 51.9,20.45 51.9,19.24 49.56,16.9 44.6,16.9 v44.3,17.2 | v42.2,16.9 32.6,16.9 31,15.3 29.3,15.3 v27.4,13.4 | v8.15,11.2 8.15,12.09 8.86,12.8 12.9,12.8 14,13.9 15.9,13.9 17.3,15.3 v17.95,15.3
N$10
  Top 0.6: C49.2 C51.2 R35.1
N$11  (via drill 0.2)
  Top 0.3: v29.15,12.45 30.4,13.7 IC3.8
  Bottom 0.3: R10.2 C10.2 17.5,11.2 18.75,12.45 v29.15,12.45
N$12
  Top 0.2: T1.G 57.48,20.27 R8.1 R9.2
N$13
  Top 0.3: 24.25,16.12 D5.A
  Top 0.6: L2.P$1 24.25,16.12
N$15
  Top 0.2: LED3.1 1.65,14.55 2.15,15.05 R5.1
N$16
  Top 0.3: 19.23,16.41 R6.2
  Top 0.4: IC7.5 19.23,16.41
N$17
  Top 0.2: IC5.14 53.06,7.87 53.26,8.06 R7.1 53.16,8.52 IC5.15
N$30
  Top 0.2: IC3.5 C27.2
  Top 0.3: C27.2 C11.1 27.89,15.12 L4.P$1
N$31
  Top 0.25: C31.2 29.34,11.39 29.34,11.74 30.82,13.22 32.03,13.22 IC3.9
  Top 0.3: C31.2 28.33,11.23 C12.1 L3.P$1
N$33  (via drill 0.2)
  Top 0.2: IC3.6 v29.67,14.7
  Bottom 0.2: R12.2 30.98,14.7 v29.67,14.7
N$34
  Top 0.2: IC3.3 30.7,16.2 30.24,16.66 30.24,18.77 C24.2 30.14,18.9 29,18.9 28.71,19.18 Q1.1
N$35
  Top 0.2: IC3.4 31.5,15.7 31.4,15.8 30.3,15.8 29.9,16.2 28,16.2 27.69,16.51 C26.2 26.79,17.45 Q1.3
SIM_CLK  (via drill 0.2)
  Top 0.2: IC1.75 v55.18,14.75
  Bottom 0.2: v55.18,14.75 58.45,14.75 59.72,13.48 CON3.C3
SIM_IO  (via drill 0.2)
  Top 0.2: IC1.79 v54.95,13.15
  Bottom 0.2: CON3.C7 66.05,14.75 65.2,13.9 60.4,13.9 59.8,14.5 59.8,15.1 59.5,15.4 55.07,15.4 54.4,14.73 54.4,13.7 v54.95,13.15
SIM_RST  (via drill 0.2)
  Top 0.2: IC1.77 v55.17,13.95
  Bottom 0.2: v55.17,13.95 56.05,13.95 56.4,14.3 58.35,14.3 60.45,12.21 CON3.C2
SPI_CLK
  Bottom 0.2: MS1.11 31.75,2.55 29.9,4.4 29.9,7.3 30.89,8.29 IC9.16
SPI_CS
  Bottom 0.2: MS1.10 29.21,7.41 30.75,8.95 IC9.17
SPI_MISO
  Bottom 0.2: MS1.13 36.83,2.37 34.5,4.7 34.5,6.7 34.2,7 IC9.14
SPI_MOSI
  Bottom 0.2: MS1.12 34.29,2.41 33.3,3.4 31.5,3.4 30.4,4.5 30.4,7 31.05,7.64 IC9.15
STAT  (via drill 0.2)
  Top 0.2: R5.2 5.15,16.05 v6.4,17.3 | v13.9,16.4 15.34,16.4 IC7.1
  Route15 0.2: v6.4,17.3 12.1,17.3 13,16.4 v13.9,16.4
STATUS  (via drill 0.2)
  Top 0.2: IC1.58 60.45,16.18 v60.45,14.7 | v60.45,21.02 60.45,21.59 R9.1
  Bottom 0.2: v60.45,14.7 60.45,17.45 59.8,18.1 59.8,20.37 v60.45,21.02
U1_3V3_RX
  Top 0.2: IC5.5 43.44,6.57 43.16,6.84 R19.2
U1_3V3_TX
  Top 0.2: R18.2 43.68,4.98 43.97,5.26 IC5.7
U2_3V3_CTS
  Top 0.2: R25.2 IC8.4
U2_3V3_RTS
  Top 0.2: R24.2 48.4,14.2 47.7,14.9 IC8.6
U2_3V3_RX
  Top 0.2: R23.2 44.7,15.3 44.95,15.55 IC8.5
U2_3V3_TX
  Top 0.2: IC8.7 47.25,14.25 47.6,13.9 47.6,13.18 47.02,12.6 R22.2
UART0_RX  (via drill 0.2)
  Top 0.2: IC1.22 64.44,7.46 v64.1,7.8 | v55.2,5.9 51.96,5.9 IC5.11
  Route15 0.2: v55.2,5.9 57.1,7.8 v64.1,7.8
UART0_TX  (via drill 0.2)
  Top 0.2: IC5.13 53.78,7.21 v54.3,6.7 | IC1.21 v64.03,4.59
  Route15 0.2: v54.3,6.7 54.3,6 54.9,5.4 63.7,5.4 64.03,5.07 v64.03,4.59
UART1_CTS  (via drill 0.2)
  Top 0.2: IC1.65 v59.24,18.25
  Route15 0.2: v72,5.8 68,5.8 66.5,7.3 66.5,18.64 65.44,19.7 60.69,19.7 v59.24,18.25
  Bottom 0.2: TP2.P$1 73.35,4.45 v72,5.8
UART1_RTS  (via drill 0.2)
  Top 0.2: IC1.61 60.7,17.54 60.7,18 60.5,18.2 v60.5,18.6
  Route15 0.2: v68.27,4.59 66.1,6.76 66.1,18.2 65.1,19.2 61.1,19.2 v60.5,18.6
  Bottom 0.2: TP4.P$1 v68.27,4.59
UART1_RX  (via drill 0.2)
  Top 0.2: IC5.10 v53.22,5.26 | v54.55,18.55 55.25,18.55 55.5,18.8 59.5,18.8 60.03,18.27 IC1.63
  Route15 0.2: v53.22,5.26 55.09,3.4 59.5,3.4 v62,0.9
  Bottom 0.2: v53.22,5.26 53.7,5.75 53.7,7.9 52.83,8.78 52.83,16.82 v54.55,18.55 | TP1.P$1 77.08,0.9 v62,0.9
UART1_TX  (via drill 0.2)
  Top 0.2: IC1.60 59.63,15.63 59.4,15.4 55.05,15.4 54.43,14.78 54.43,14.03 v52,11.6 | v53.09,6.57 IC5.12
  Route15 0.2: v53.09,6.57 55.45,4.2 60.2,4.2 63.1,1.3 69.7,1.3 v70.81,2.41
  Bottom 0.2: v53.09,6.57 52.44,6.57 52,7 v52,11.6 | TP3.P$1 v70.81,2.41
UART2_CTS  (via drill 0.2)
  Top 0.2: IC1.53 64.05,17.41 64.05,18.9 63.24,19.7 v58.63,19.7 | IC8.11 53,14.9 v54.3,16.2
  Bottom 0.2: v58.63,19.7 55.13,16.2 v54.3,16.2
UART2_RTS
  Top 0.2: IC1.55 63.23,18.51 62.6,19.15 54.3,19.15 53.6,18.45 53.6,16.96 52.84,16.2 IC8.13
UART2_RX  (via drill 0.2)
  Top 0.2: v63.65,14.85 63.65,16.18 IC1.50 | IC8.10 v53.49,14.25 v53.49,14.24
  Route15 0.2: v63.65,14.85 63.65,15.39 62.84,16.2 55.8,16.2 55.65,16.2 55.45,16.2 v53.49,14.24
UART2_TX  (via drill 0.2)
  Top 0.2: v64.45,15.15 64.44,15.16 IC1.48 | v54.65,17.4 52.8,15.55 IC8.12
  Route15 0.2: v64.45,15.15 64.45,16.3 63.35,17.4 v54.65,17.4
USB_5V  (via drill 0.2)
  Top 0.2: IC7.4 17.98,14.52 18,14.5
  Top 0.3: v1.75,17.55 LED3.2 | v18.9,17.2 19.2,17.2 19.4,17.4 D7.A
  Top 0.5: C39.2 17.96,14.5 IC7.4
  Top 0.6: C39.2 D5.K 21.3,18.45 R4.2 21.23,18.41 D7.A
  Route15 0.3: v18.9,17.2 13,17.2 12.2,18 3.6,18 3.15,17.55 v1.75,17.55
VBAT  (via drill 0.2)
  Top 0.5: 13.2,17.7 v13.5,18 | C15.1 15.33,14.54 IC7.3
  Top 0.6: 13.2,17.7 v13.2,15.8 13.78,15.22 C15.1 | v13.5,18 13.06,17.56 D8.A
  Route15 0.6: v8.2,15.8 v13.2,15.8
  Bottom 0.6: MS1.28 16.51,19.31 15.2,18 v13.5,18 | 9,15.5 C0N2.1 8.8,15.8 v8.2,15.8
VBUS  (via drill 0.2)
  Top 0.6: v24.91,14.01 L2.P$2
  Route15 0.3: v9.46,9.86 v8.25,8.65
  Route15 0.6: v14.6,10.5 17.8,13.7 24.6,13.7 v24.91,14.01
  Bottom 0.3: v9.46,9.86 IC6.5 10.81,9.86 11.46,10.5 v14.6,10.5
  Bottom 0.4: CON1.1 v8.25,8.65 8.25,5.85 TP9.P$1
VCC_SIM  (via drill 0.2)
  Top 0.2: IC1.72 v58.19,13.55
  Bottom 0.3: CON3.C1 66.94,9.63 C3.1 62.1,9.63 v58.19,13.55
WAKEUP_3V3  (via drill 0.2)
  Top 0.2: S2.6 10.88,21.86 S2.3 v12.05,21.86 S2.4 14.73,21.86 S2.5
  Route15 0.2: v31.49,6.35 29.4,8.44 29.4,11.1 30.2,11.9 30.2,15.56 32.2,17.56 v32.2,20.3
  Bottom 0.2: v12.05,21.86 12.05,18.55 13.66,16.93 R43.1 16.14,16.93 19.5,20.3 v32.2,20.3 35.14,20.3 D6.1 | IC9.13 v31.49,6.35

## Text on the board
bNames: For evaluation only; / For professional use only; / Not CE / FCC approved for resale; | Nano Simcard | Würth Elektronik eiSos GmbH & Co. KG / Max-Eyth-Straße1, 74638 Waldenburg | ADC | R16 | R17
tprint: BAT | EN | 5V | 13 | UTX1 | 9 | 6 | SCL | SDA | GNSS | RESET | WAKEUP | R4 | 2615011136000 | Charging | R6 | Status | Power | LTE | R2 | RST | 3V3 | AREF | GND | A0 | A1 | A2 | A3 | A4 | SCS | SCK | MOSI | MISO | U0RX | U0TX | NC | Adrastea-I / FeatherWing | HW-V1